# Altium schematic sheet OutputStage.SchDoc: Output Stage
size A4; Organization: BME AUT; Address1: Magyar tudósok krt. 2.; Address2: Q épület; Address3: Budapest; Address4: H-1117; DocumentNumber: 1; Revision: 1.0; SheetNumber: 1; SheetTotal: 2
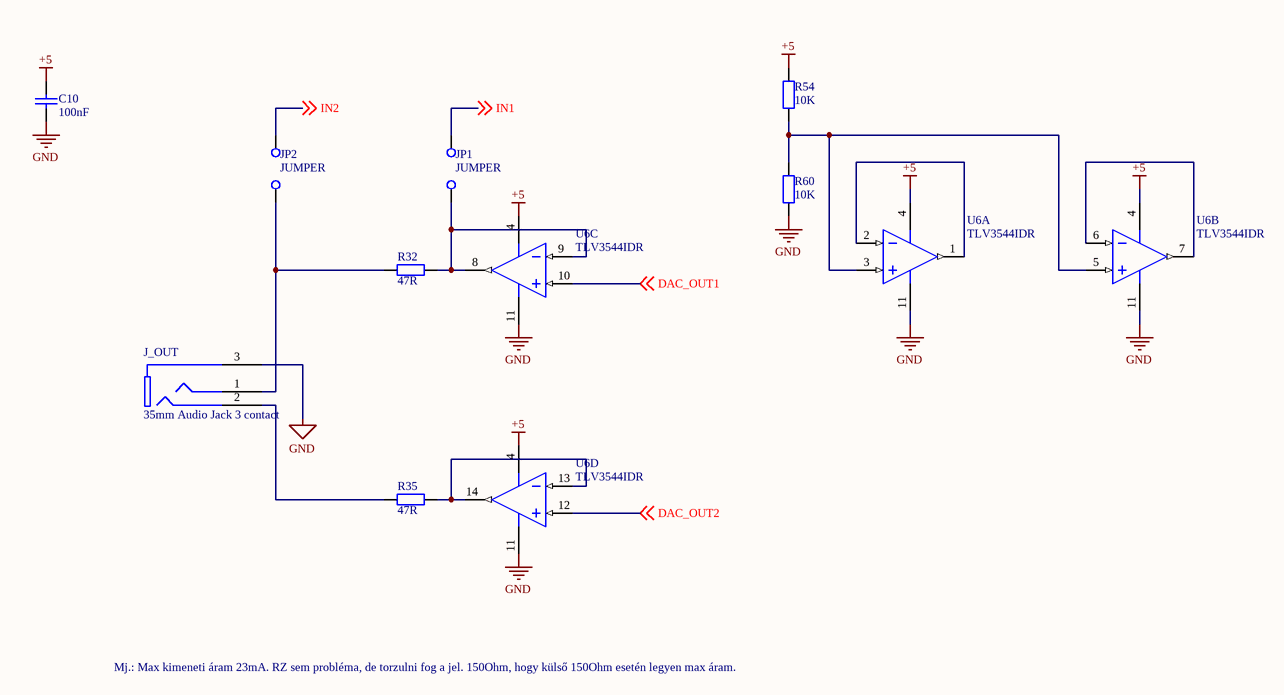
[diagram p0: OutputStage.SchDoc]

## Parts
C10  100nF  [FP_0805_CAP_085]
J_OUT  35mm Audio Jack 3 contact  [FP_35MM_JACK_SMALL_3PIN]
JP1  JUMPER  [FP_CONN2_TUSKE_254MM]
JP2  JUMPER  [FP_CONN2_TUSKE_254MM]
R32  47R  [FP_0805_RES]
R35  47R  [FP_0805_RES]
R54  10K  [FP_0805_RES]
R60  10K  [FP_0805_RES]
U6  TLV3544IDR  [FP_SOIC127P600X175-14M]  (parts A,B,C,D of 4)

## Nets
+5: C10.2 R54.2 U6.4(V+)
GND: C10.1 J_OUT.3(GND) R60.1 U6.11(GND)
DAC_OUT1: U6.10(IN3+) ; off-sheet DAC_OUT1
DAC_OUT2: U6.12(IN4+) ; off-sheet DAC_OUT2
IN1: JP1.2(C2) ; off-sheet IN1
IN2: JP2.1(C1) ; off-sheet IN2
NetJ_OUT_1: J_OUT.1(SLEEVE1) JP2.2(C2) R32.1
NetJ_OUT_2: J_OUT.2(TIP) R35.1
NetJP1_1: JP1.1(C1) R32.2 U6.8(OUT3) U6.9(IN3-)
NetR35_2: R35.2 U6.13(IN4-) U6.14(OUT4)
NetR54_1: R54.1 R60.2 U6.3(IN1+) U6.5(IN2+)
NetU6_1: U6.1(OUT1) U6.2(IN1-)
NetU6_6: U6.6(IN2-) U6.7(OUT2)

## Notes on the sheet
- Mj.: Max kimeneti áram 23mA. RZ sem probléma, de torzulni fog a jel. 150Ohm, hogy külső 150Ohm esetén legyen max áram.
- Title
- Size:
- Date:
- A4
- Number:
- Time:
- Revision:
- Sheet
- of
- File:

## Library data of the parts
C10 = CAP 100nF: Capacitor; Tolerance: 10%; Voltage: 50V; Name: 100nF 0805 10% 50V X7R 0805B104K500CT (WAL); Supplier: Lomex; Reference: 82-10-76; Value: 100nF
J_OUT = 35mm Audio Jack 3 contact: 3.5mm Audio Jack MX-387GL; Name: MX-387GL -  Phone Audio Connector, 3 Contacts, Jack, 3.5 mm, PCB Mount, Metal Body; Reference: 1267376; Supplier: Farnell
JP1 JP2 = JUMPER: Jumper Wire
R32 R35 = RES 47R: Resistor; Tolerance: 5%; Power: 125mW; Name: 47R0 0805 5% WR08X470JTL 0.125W (WAL); Supplier: Lomex; Reference: 81-28-06; Value: 47R
R54 R60 = RES 10K: Resistor; Tolerance: 5%; Power: 125mW; Name: 10K0 0805 5% CR-05JL7---10K 0.125W (VIK); Supplier: Lomex; Reference: 81-30-45; Value: 10K
U6 = TLV3544IDR: Operational Amplifier, RRIO, 4 Amplifier, 200 MHz, 150 V/µs, 2.5V to 5.5V, ± 1.25V to ± 2.75V, SOIC; Reference: 2851094; Name: TLV3544IDR . -  Operational Amplifier; Supplier: Farnell